# EAGLE design Feather_j-link (EAGLE 9.6.2)
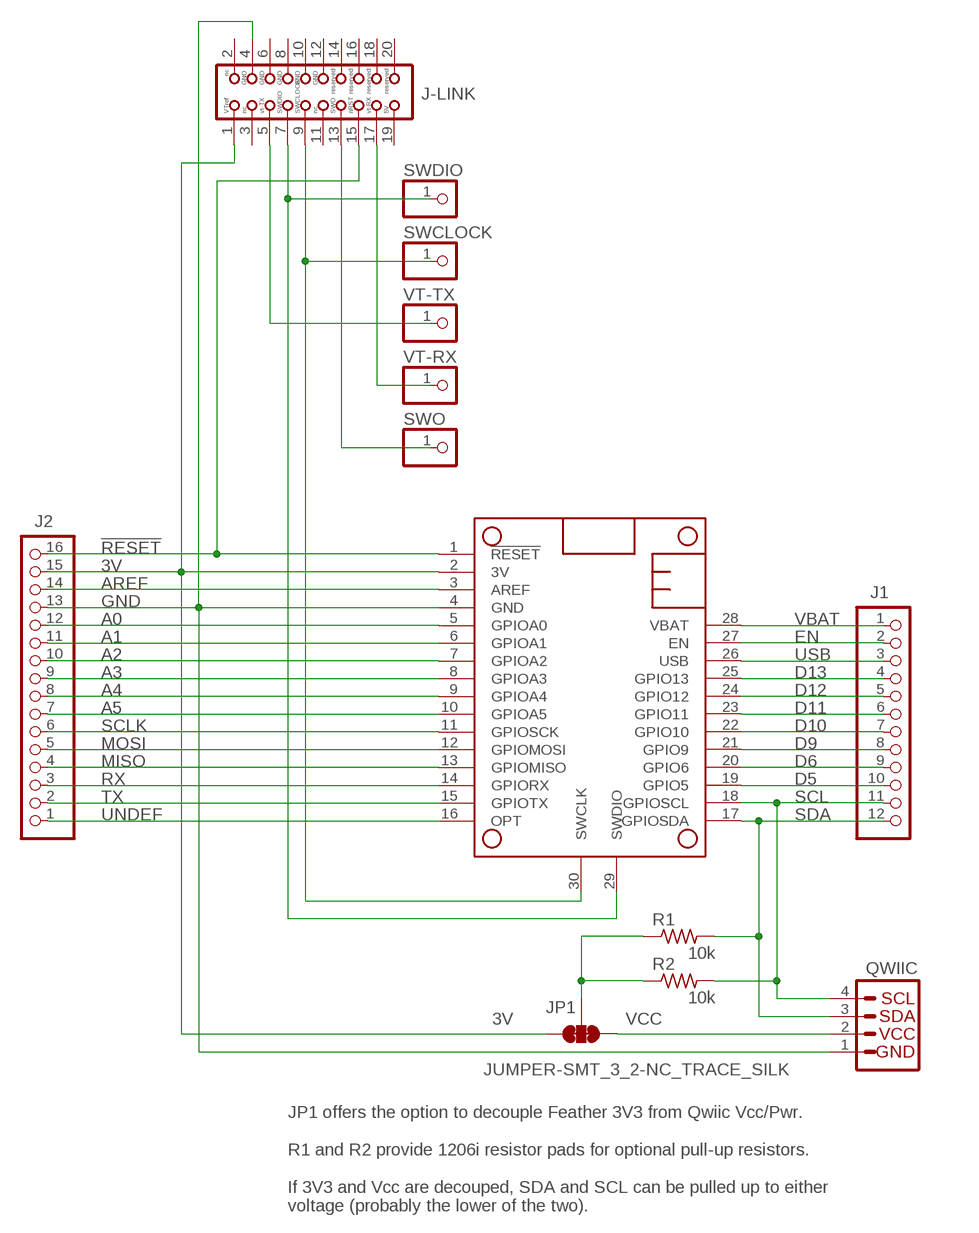
[diagram p0: schematic, sheet 1]

## Parts
J1  HEADER-1X1276MIL  [1X12_ROUND_76MIL]
J2  HEADER-1X16ROUND  [1X16_ROUND]
J-LINK  JLINK-ARM  [JTAG-ARM]
JP1  JUMPER-SMT_3_2-NC_TRACE_SILK  [SMT-JUMPER_3_2-NC_TRACE_SILK]
MS2  FEATHERWING-SWD-SWD  [FEATHERWING_DIM_SWD]
QWIIC  QWIIC_CONNECTORJS-1MM  [1X04_1MM_RA]
R1  10k  R-US_M1206  [M1206]
R2  10k  R-US_M1206  [M1206]
SWCLOCK  PINHD-1X1  [1X01]
SWDIO  PINHD-1X1  [1X01]
SWO  PINHD-1X1  [1X01]
VT-RX  PINHD-1X1  [1X01]
VT-TX  PINHD-1X1  [1X01]

## Nets
3V [I2C]: J2.15 J-LINK.1 JP1.3 MS2.2(3V)
!RESET: J2.16 J-LINK.15 MS2.1(!RESET)
A0: J2.12 MS2.5(GPIOA0)
A1: J2.11 MS2.6(GPIOA1)
A2: J2.10 MS2.7(GPIOA2)
A3: J2.9 MS2.8(GPIOA3)
A4: J2.8 MS2.9(GPIOA4)
A5: J2.7 MS2.10(GPIOA5)
AREF: J2.14 MS2.3(AREF)
D5: J1.10 MS2.19(GPIO5)
D6: J1.9 MS2.20(GPIO6)
D9: J1.8 MS2.21(GPIO9)
D10: J1.7 MS2.22(GPIO10)
D11: J1.6 MS2.23(GPIO11)
D12: J1.5 MS2.24(GPIO12)
D13: J1.4 MS2.25(GPIO13)
EN: J1.2 MS2.27(EN)
GND [I2C]: J2.13 J-LINK.4 MS2.4(GND) QWIIC.1(GND)
MISO: J2.4 MS2.13(GPIOMISO)
MOSI: J2.5 MS2.12(GPIOMOSI)
PULL-UP: JP1.2 R1.1 R2.1
RX: J2.3 MS2.14(GPIORX)
SCL: J1.11 MS2.18(GPIOSCL) QWIIC.4(SCL) R2.2
SCLK: J2.6 MS2.11(GPIOSCK)
SDA: J1.12 MS2.17(GPIOSDA) QWIIC.3(SDA) R1.2
SWCLOCK: J-LINK.9 MS2.30(SWCLK) SWCLOCK.1
SWDIO: J-LINK.7 MS2.29(SWDIO) SWDIO.1
SWO: J-LINK.13 SWO.1
TX: J2.2 MS2.15(GPIOTX)
UNDEF: J2.1 MS2.16(OPT)
USB: J1.3 MS2.26(USB)
VBAT: J1.1 MS2.28(VBAT)
VCC [I2C]: JP1.1 QWIIC.2(VCC)
VT-RX: J-LINK.17 VT-RX.1
VT-TX: J-LINK.5 VT-TX.1
Unconnected: J-LINK.2 J-LINK.3 J-LINK.6 J-LINK.8 J-LINK.10 J-LINK.11 J-LINK.12 J-LINK.14 J-LINK.16 J-LINK.18 J-LINK.19 J-LINK.20

## Notes on the sheet
- JP1 offers the option to decouple Feather 3V3 from Qwiic Vcc/Pwr.
  
  R1 and R2 provide 1206i resistor pads for optional pull-up resistors.
  
  If 3V3 and Vcc are decouped, SDA and SCL can be pulled up to either
  voltage (probably the lower of the two).

## Library data of the parts
J1 = microbuilder:HEADER-1X12
J2 = microbuilder:HEADER-1X16: PIN HEADER
J-LINK = home:JLINK-ARM: 20 Pin JTAG Connector For use with ARM7, and ARM9. Supported by some Cortex M3 boards with SWJ-DP interfaces (dual SWP/JTAG support). 4UConnector: 03556
JP1 = SparkFun-Jumpers:JUMPER-SMT_3_2-NC_TRACE: Normally closed trace jumper (2 of 2 connections) This jumper has a trace between all three pads so they are normally closed (NC). Use a razor knife to open the connection(s). For best results follow the IPC guidelines for cutting traces: Cutout at least 0.063 mm (0.005 in). Remove all loose material to clean up the cut area. Seal the cut with an approved epoxy. Reapply solder to reclose the connection(s).
MS2 = home:FEATHERWING-SWD
QWIIC = SparkFun-Connectors:QWIIC_CONNECTOR: SparkFun I2C Standard Qwiic Connector An SMD 1mm pitch JST connector makes it easy and quick (get it? Qwiic?) to connect I2C devices to each other. The Qwiic system <http://www.sparkfun.com/qwiic> enables fast and solderless connection between popular platforms and various sensors and actuators. We carry 200mm <https://www.sparkfun.com/products/14204>, 100mm <https://www.sparkfun.com/products/14205>, 50mm <https://www.sparkfun.com/products/14206>, and breadboard friendly <https://www.sparkfun.com/products/14207> Qwiic cables. We also offer 10 pcs strips <https://www.sparkfun.com/products/14323> the SMD connectors.
R1 R2 = adafruit:R-US_: RESISTOR, American symbol
SWCLOCK SWDIO SWO VT-RX VT-TX = adafruit:PINHD-1X1: Pin header 1x1 for 0.1" spacing With round pins

## Net classes
0 default: width 0.203 mm, clearance 0.203 mm
1 I2C: width 0.305 mm, clearance 0.254 mm

## Board
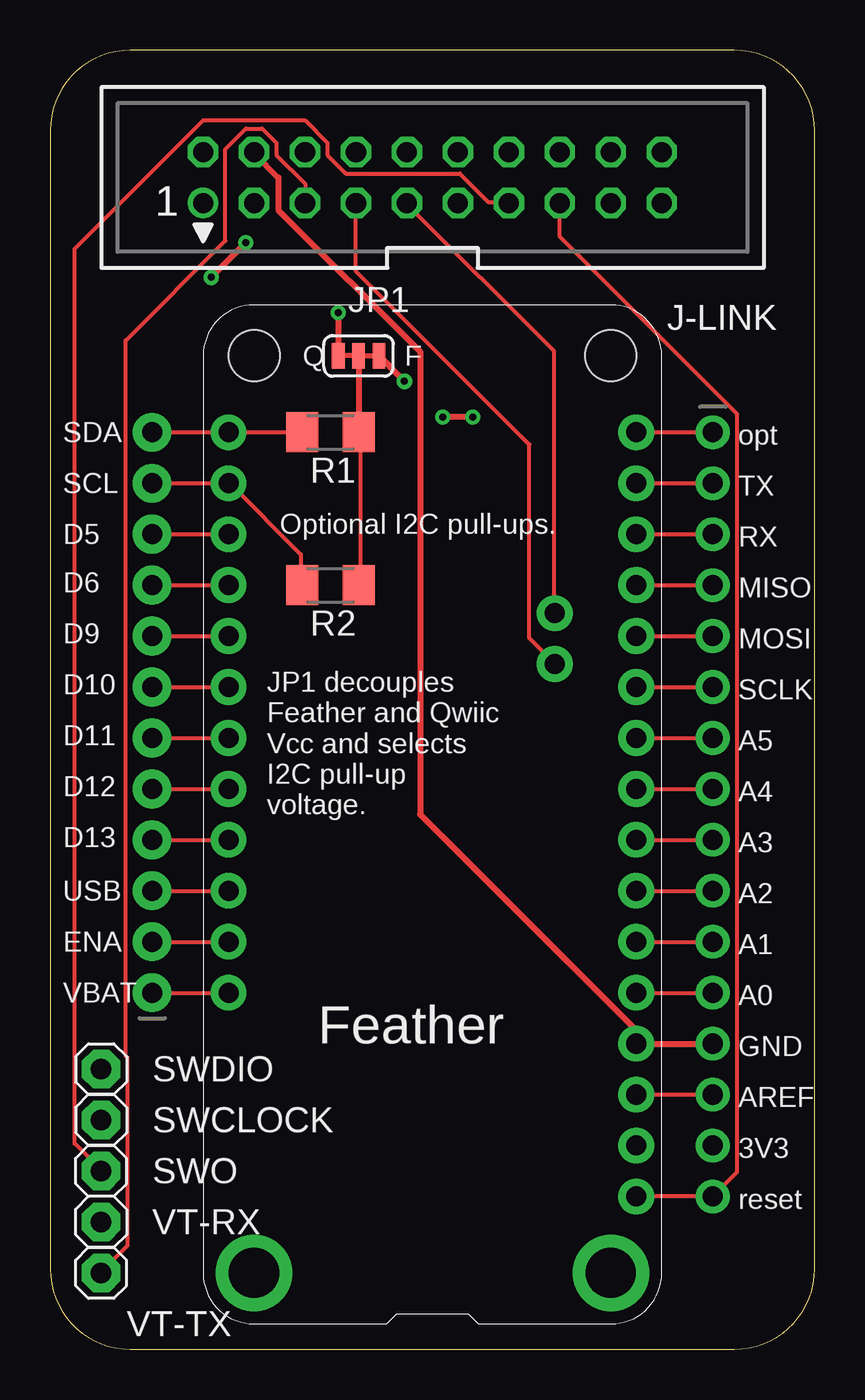
[diagram p1: board, top side]
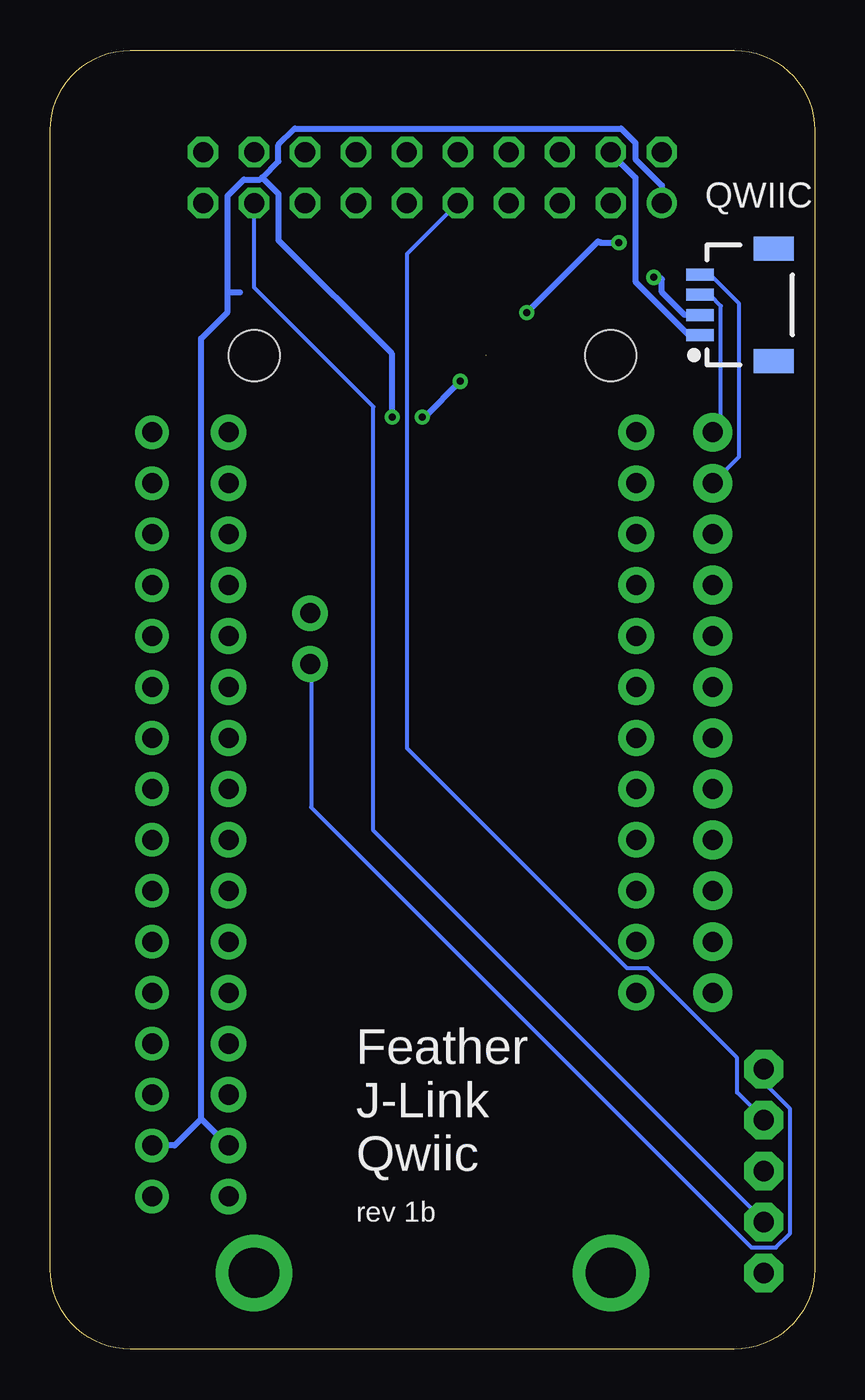
[diagram p2: board, bottom side, seen from below]

Size 38.1 x 64.77 mm. Coordinates in mm from the lower left corner, seen from the top.
Outline: 34.1,64.77 4,64.77 arc90 0,60.77 0,4 arc90 4,0 34.1,0 arc90 38.1,4 38.1,60.77 arc90 34.1,64.77
Copper layers (1*16): Top 0.035mm / dielectric 1.5mm / Bottom 0.035mm
Design rules "default": minimum track width 6mil, minimum drill 0.35mm, track to track 6mil, track to pad 6mil, pad to pad 6mil, via to via 6mil, smd to smd 6mil, copper to edge 40mil, drill to drill 6mil, minimum pad ring 10mil, minimum via ring 8mil, stop-mask expansion 4mil, vias tented up to drill 0mil, thermal gap 10mil

### Footprints (pad centres in the part's own frame; a part is rotated, then mirrored left to right if it is on the bottom)
1X12_ROUND_76MIL = drill 1 pad 1.93: 1 -13.97,0; 2 -11.43,0; 3 -8.89,0; 4 -6.35,0; 5 -3.81,0; 6 -1.27,0; 7 1.27,0; 8 3.81,0; 9 6.35,0; 10 8.89,0; 11 11.43,0; 12 13.97,0
1X16_ROUND = drill 1 pad 1.676: 1 -19.05,0; 2 -16.51,0; 3 -13.97,0; 4 -11.43,0; 5 -8.89,0; 6 -6.35,0; 7 -3.81,0; 8 -1.27,0; 9 1.27,0; 10 3.81,0; 11 6.35,0; 12 8.89,0; 13 11.43,0; 14 13.97,0; 15 16.51,0; 16 19.05,0
JTAG-ARM = drill 1: 1 -11.43,-1.27 | drill 1 octagon: 2 -11.43,1.27; 3 -8.89,-1.27; 4 -8.89,1.27; 5 -6.35,-1.27; 6 -6.35,1.27; 7 -3.81,-1.27; 8 -3.81,1.27; 9 -1.27,-1.27; 10 -1.27,1.27; 11 1.27,-1.27; 12 1.27,1.27; 13 3.81,-1.27; 14 3.81,1.27; 15 6.35,-1.27; 16 6.35,1.27; 17 8.89,-1.27; 18 8.89,1.27; 19 11.43,-1.27; 20 11.43,1.27
SMT-JUMPER_3_2-NC_TRACE_SILK = smd 0.635 x 1.27: 1 -1.016,0; 2 0,0; 3 1.016,0
FEATHERWING_DIM_SWD = drill 1 pad 1.778: 1 6.35,1.27; 2 8.89,1.27; 3 11.43,1.27; 4 13.97,1.27; 5 16.51,1.27; 6 19.05,1.27; 7 21.59,1.27; 8 24.13,1.27; 9 26.67,1.27; 10 29.21,1.27; 11 31.75,1.27; 12 34.29,1.27; 13 36.83,1.27; 14 39.37,1.27; 15 41.91,1.27; 16 44.45,1.27; 17 44.45,21.59; 18 41.91,21.59; 19 39.37,21.59; 20 36.83,21.59; 21 34.29,21.59; 22 31.75,21.59; 23 29.21,21.59; 24 26.67,21.59; 25 24.13,21.59; 26 21.59,21.59; 27 19.05,21.59; 28 16.51,21.59; 29 32.893,5.334; 30 35.433,5.334 | drill 2.5 pad 3.81: P$1 2.54,20.32; P$2 2.54,2.54 | hole 2.54: 48.26,20.32; 48.26,2.54
1X04_1MM_RA = smd 0.6 x 1.35: 1 -1.5,0; 2 -0.5,0; 3 0.5,0; 4 1.5,0 | smd 1.2 x 2: NC1 2.8,-3.675; NC2 -2.8,-3.675
M1206 = smd 1.6 x 2: 1 -1.4,0; 2 1.4,0
1X01 = drill 1.016 pad 1.93 octagon: 1 0,0

### Placement (x,y rotation side)
J1  5.08,31.75 90 top
J2  33.02,26.67 270 top
J-LINK  19.05,58.42 0 top
JP1  15.37,49.53 0 top
MS2  30.48,1.27 90 top
QWIIC  5.71,52.07 90 bottom
R1  13.97,45.72 180 top
R2  13.97,38.1 180 top
SWCLOCK  2.54,11.43 0 top
SWDIO  2.54,13.97 0 top
SWO  2.54,8.89 180 top
VT-RX  2.54,6.35 270 top
VT-TX  2.54,3.81 180 top

### Tracks (layer width: path | path; a pad name or v marks a point on that pad's centre or on a via)
3V  (via drill 0.35)  (1 unrouted)
  Top 0.305: v21.05,46.48 v19.56,46.48 | v17.66,48.26 16.92,49 16.92,49.02 16.38,49.55
  Bottom 0.305: J-LINK.1 7.62,58.01 8.94,59.33 8.94,60.15 9.65,60.86 25.91,60.86 26.72,60.05 26.72,59.23 27.53,58.42 | 27.53,58.42 27.64,58.32 28.45,58.32 29.26,57.51 29.26,52.7 | 29.26,52.7 29.26,51.71 30.58,50.39 30.58,11.48 | 30.58,11.48 29.26,10.16 MS2.2 | J2.15 31.9,10.16 30.58,11.48 | 29.26,52.7 28.65,52.7 | 27.53,58.42 26.72,57.61 26.72,55.3 21.08,49.66 21.08,46.51 v21.05,46.48 | v19.56,46.48 19.43,46.48 v17.66,48.26
!RESET
  Top 0.203: J-LINK.15 25.4,55.47 34.24,46.63 34.24,8.84 J2.16 MS2.1
A0
  Top 0.203: MS2.5 J2.12
A1
  Top 0.203: MS2.6 J2.11
A2
  Top 0.203: MS2.7 J2.10
A3
  Top 0.203: MS2.8 J2.9
A4
  Top 0.203: MS2.9 J2.8
A5
  Top 0.203: MS2.10 J2.7
AREF
  Top 0.203: MS2.3 J2.14
D5
  Top 0.203: J1.10 MS2.19
D6
  Top 0.203: J1.9 MS2.20
D9
  Top 0.203: J1.8 MS2.21
D10
  Top 0.203: J1.7 MS2.22
D11
  Top 0.203: J1.6 MS2.23
D12
  Top 0.203: J1.5 MS2.24
D13
  Top 0.203: J1.4 MS2.25
EN
  Top 0.203: J1.2 MS2.27
GND
  Top 0.305: J2.13 MS2.4 29.16,15.34 29.16,15.95 18.44,26.67 18.44,49.73 11.38,56.79 11.38,58.42 10.16,59.64 J-LINK.4
  Bottom 0.305: QWIIC.1 5.79,50.6 6.3,50.6 8.94,53.24 8.94,58.42 10.16,59.64 J-LINK.4
MISO
  Top 0.203: MS2.13 J2.4
MOSI
  Top 0.203: MS2.12 J2.5
PULL-UP
  Top 0.203: R2.1 15.44,38.1 15.44,45.72 R1.1
  Top 0.305: JP1.2 R1.1
RX
  Top 0.203: MS2.14 J2.3
SCL
  Top 0.203: R2.2 12.5,38.1 12.5,39.62 8.94,43.18 MS2.18 J1.11
  Bottom 0.203: J1.11 3.76,44.5 3.76,52.12 5.18,53.54 5.69,53.54 QWIIC.4
SCLK
  Top 0.203: MS2.11 J2.6
SDA
  Top 0.203: R1.2 MS2.17 J1.12
  Bottom 0.203: J1.12 4.67,46.13 4.67,52.02 5.18,52.53 5.69,52.53 QWIIC.3
SWCLOCK
  Top 0.203: MS2.30 25.09,36.78 25.09,49.78 17.78,57.1 J-LINK.9
  Bottom 0.203: J-LINK.9 20.32,54.61 20.32,29.97 9.35,19 8.33,19 3.86,14.53 3.86,12.8 2.54,11.48 SWCLOCK.1
SWDIO
  Top 0.203: J-LINK.7 15.24,53.75 23.88,45.11 23.88,35.46 25.09,34.24 MS2.29
  Bottom 0.203: SWDIO.1 2.54,13.31 1.22,11.99 1.22,5.79 1.93,5.08 3.15,5.08 25.09,27.03 25.09,34.14 MS2.29
SWO
  Top 0.203: J-LINK.13 22.86,57.2 21.84,57.2 20.42,58.62 14.73,58.62 13.82,59.54 13.82,60.15 12.7,61.27 7.62,61.27 1.22,54.86 1.22,10.26 2.54,8.94 SWO.1
TX
  Top 0.203: MS2.15 J2.2
UNDEF
  Top 0.203: MS2.16 J2.1
USB
  Top 0.203: J1.3 MS2.26
VBAT
  Top 0.203: J1.1 MS2.28
VCC  (via drill 0.35)
  Top 0.305: v9.75,55.17 v8.03,53.44 | v14.35,51.69 JP1.1
  Bottom 0.305: QWIIC.2 6.48,51.57 7.62,52.71 7.62,53.34 7.72,53.44 v8.03,53.44 | v14.35,51.69 10.81,55.23 10.67,55.17 v9.75,55.17
VT-RX
  Bottom 0.203: J-LINK.17 27.94,52.93 22,46.99 22,25.86 2.54,6.4 VT-RX.1
VT-TX
  Top 0.203: J-LINK.5 12.7,58.12 11.28,59.54 11.28,60.15 10.57,60.86 9.75,60.86 8.74,59.84 8.74,55.27 3.76,50.29 3.76,14.63 3.86,14.53 3.86,5.18 2.54,3.86 VT-TX.1

### Text on the board
tPlace: Q | F | Optional I2C pull-ups. | JP1 decouples / Feather and Qwiic / Vcc and selects / I2C pull-up / voltage.
tNames: SDA | opt | SCL | TX | D5 | RX | D6 | MISO | D9 | MOSI | D10 | SCLK | D11 | A5 | D12 | A4 | D13 | A3 | USB | A2 | ENA | A1 | VBAT | A0 | Feather | GND | AREF | 3V3 | reset
bNames: Feather / J-Link / Qwiic | rev 1b